# Altium schematic sheet MCU (nrf52840).SchDoc
size A; SheetNumber: 3; SheetTotal: 4
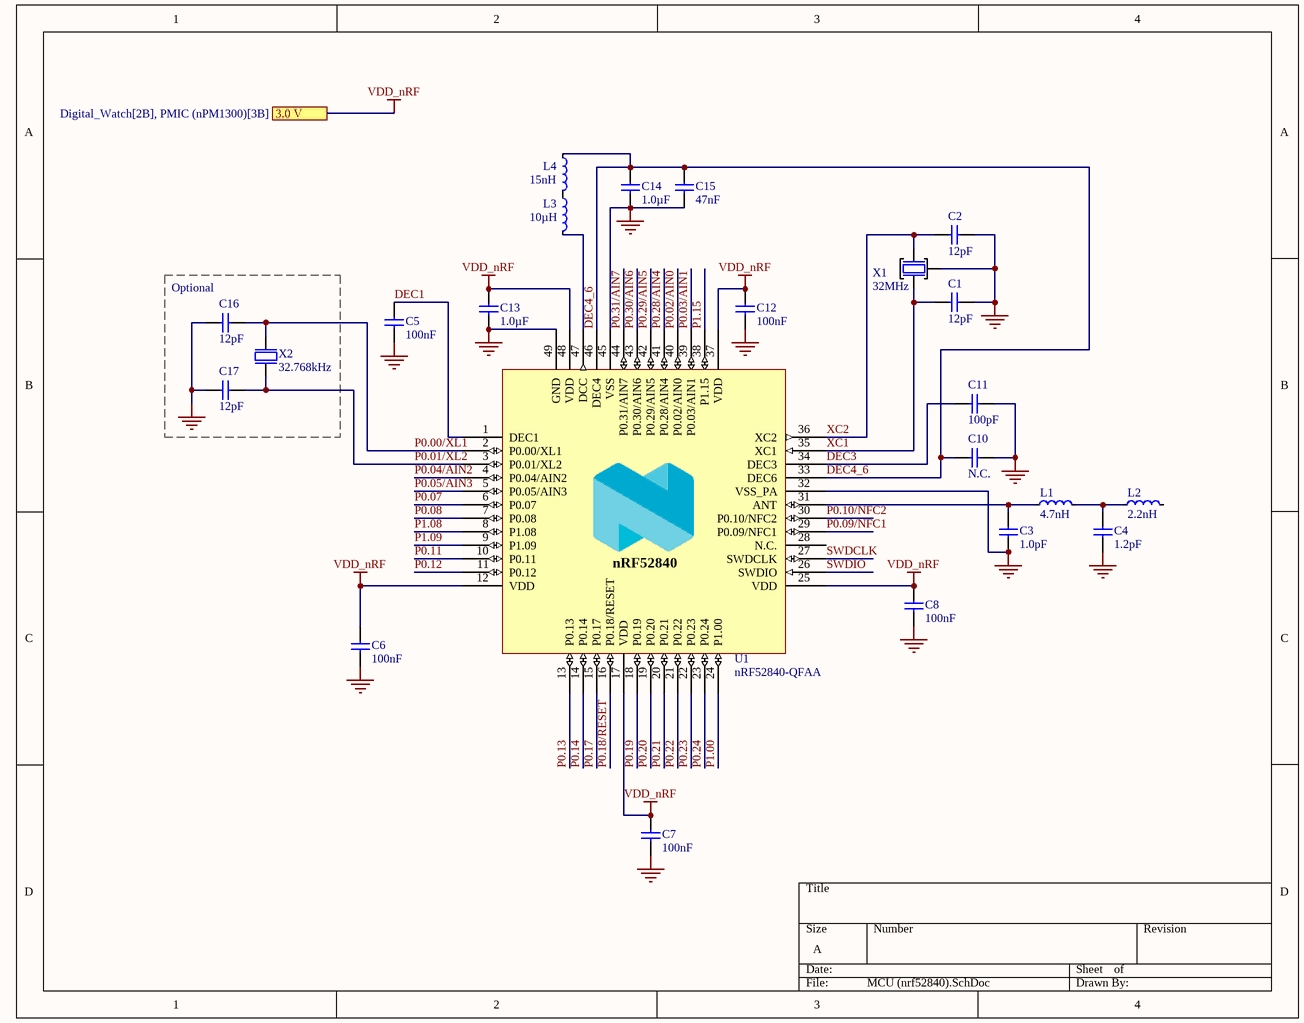
[diagram p0: MCU (nrf52840).SchDoc]

## Parts
C1  12pF  [CAPC0603X03L_C]
C2  12pF  [CAPC0603X03L_C]
C3  1.0pF  [CAPC0603X03L_C]
C4  1.2pF  [CAPC0603X03L_C]
C5  100nF  [CAPC0603X03L_C]
C6  100nF  [CAPC0603X03L_C]
C7  100nF  [CAPC0603X03L_C]
C8  100nF  [CAPC0603X03L_C]
C10  N.C.  [CAPC0603X03L_C_NC]
C11  100pF  [CAPC0603X03L_C]
C12  100nF  [CAPC0603X03L_C]
C13  1.0µF  [CAPC1005X04L]
C14  1.0µF  [CAPC1005X04L]
C15  47nF  [CAPC0603X03L_C]
C16  12pF  [CAPC0603X03L_C]
C17  12pF  [CAPC0603X03L_C]
L1  4.7nH  [INDC0603X03L_C]
L2  2.2nH  [INDC0603X03L_C]
L3  10µH  [INDC1608X06L]
L4  15nH  [INDC1005X04L]
U1  nRF52840-QFAA  [QFN40P600X600X90-48N]
X1  32MHz  [XTAL_2016_NT]
X2  32.768kHz  [XTAL_2012]

## Blocks framed on the sheet
Optional: C16 C17 X2

## Ports
3.0 V (see Digital_Watch[2B], PMIC (nPM1300)[3B])

## Nets
GND: C1.2 C2.2 C3.1 C4.1 C5.2 C6.2 C7.2 C8.2 C10.1 C11.2 C12.2 C13.2 C14.1 C15.2 C16.2 C17.2 U1.32(VSS_PA) U1.45(VSS) U1.49(GND) X1.2(GND)
VDD_nRF: C6.1 C7.1 C8.1 C12.1 C13.1 U1.12(VDD) U1.17(VDD) U1.25(VDD) U1.37(VDD) U1.48(VDD) ; port 3.0 V
DEC1: C5.1 U1.1(DEC1)
DEC3: C11.1 U1.34(DEC3)
DEC4_6: C10.2 C14.2 C15.1 L4.1 U1.33(DEC6) U1.46(DEC4)
P0.00/XL1: C16.1 U1.2(P0.00/XL1) X2.1(inp)
P0.01/XL2: C17.1 U1.3(P0.01/XL2) X2.2(out)
P0.02/AIN0: U1.40(P0.02/AIN0)
P0.03/AIN1: U1.39(P0.03/AIN1)
P0.04/AIN2: U1.4(P0.04/AIN2)
P0.05/AIN3: U1.5(P0.05/AIN3)
P0.07: U1.6(P0.07)
P0.08: U1.7(P0.08)
P0.09/NFC1: U1.29(P0.09/NFC1)
P0.10/NFC2: U1.30(P0.10/NFC2)
P0.11: U1.10(P0.11)
P0.12: U1.11(P0.12)
P0.13: U1.13(P0.13)
P0.14: U1.14(P0.14)
P0.17: U1.15(P0.17)
P0.18/RESET: U1.16(P0.18/RESET)
P0.19: U1.18(P0.19)
P0.20: U1.19(P0.20)
P0.21: U1.20(P0.21)
P0.22: U1.21(P0.22)
P0.23: U1.22(P0.23)
P0.24: U1.23(P0.24)
P0.28/AIN4: U1.41(P0.28/AIN4)
P0.29/AIN5: U1.42(P0.29/AIN5)
P0.30/AIN6: U1.43(P0.30/AIN6)
P0.31/AIN7: U1.44(P0.31/AIN7)
P1.00: U1.24(P1.00)
P1.08: U1.8(P1.08)
P1.09: U1.9(P1.09)
P1.15: U1.38(P1.15)
SWDCLK: U1.27(SWDCLK)
SWDIO: U1.26(SWDIO)
XC1: C1.1 U1.35(XC1) X1.1(IN)
XC2: C2.1 U1.36(XC2) X1.3(OUT)
NetC3_2: C3.2 L1.1 U1.31(ANT)
NetC4_2: C4.2 L1.2 L2.1
NetL3_1: L3.1 L4.2
NetL3_2: L3.2 U1.47(DCC)

Not connected (* = marked no-connect by the designer): L2 2; U1 28(N.C.)

## Notes on the sheet
- (in symbol nRF52840-QFAA) nRF52840

## Library data of the parts
C1 C2 C16 C17 = C0201-12p: Capacitor, NP0, ±2%; Pad Count: 2; Part Number: C0201-12p; LatestRevisionDate: 2017-11-09; Published: 2014-11-13; Value: 12pF; Footprint Doc: 0201; Component Class: Capacitors
C3 = C0201-1.0p: Capacitor, NP0, ±10%; Pad Count: 2; Part Number: C0201-1.0p; LatestRevisionDate: 2018-10-22; Published: 2014-11-13; Value: 1.0pF; Footprint Doc: 0201; Component Class: Capacitors
C4 = C0201-1.2p: Capacitor, NP0, ±10%; Pad Count: 2; Part Number: C0201-1.2p; LatestRevisionDate: 2020-10-13; Published: 2014-11-13; Value: 1.2pF; Footprint Doc: 0201; Component Class: Capacitors
C5-C8 C12 = C0201-100n: Capacitor, X5R, ±10%; Pad Count: 2; Part Number: C0201-100n; LatestRevisionDate: 2017-11-09; Published: 2014-11-13; Value: 100nF; Footprint Doc: 0201; Component Class: Capacitors
C10 = C0201-N.C.: Not mounted; Assembly: Not mounted; Pad Count: 2; Part Number: C0201-N.C.; LatestRevisionDate: 2014-11-13; Published: 2014-11-13; Value: N.C.; Footprint Doc: 0201; Component Class: Capacitors
C11 = C0201-100p: Capacitor, NP0, ±5%; Pad Count: 2; Part Number: C0201-100p; LatestRevisionDate: 2019-04-16; Published: 2019-04-16; Value: 100pF; Footprint Doc: 0201; Component Class: Capacitors
C13 C14 = C0402-1µ0: Capacitor, X5R, ±10%; Pad Count: 2; Part Number: C0402-1µ0; LatestRevisionDate: 2016-08-22; Published: 2009-05-08; Value: 1.0µF; Footprint Doc: 0402; Component Class: Capacitors
C15 = C0201-47n: Capacitor, X5R, ±10%; Pad Count: 2; Part Number: C0201-47n; LatestRevisionDate: 2017-11-09; Published: 2014-11-13; Value: 47nF; Footprint Doc: 0201; Component Class: Capacitors
L1 = L0201-4n7: High frequency chip inductor ±5%; Pad Count: 2; Part Number: L0201-4n7; LatestRevisionDate: 2013-04-10; Published: 2013-04-10; Value: 4.7nH; Footprint Doc: 0201; Component Class: Inductors
L2 = L0201-2n2: High frequency chip inductor ±5%; Pad Count: 2; Part Number: L0201-2n2; LatestRevisionDate: 2013-04-10; Published: 2013-04-10; Value: 2.2nH; Footprint Doc: 0201; Component Class: Inductors
L3 = L0603-10µ-TDK: Chip inductor, IDC,min = 50 mA, ±20%; Pad Count: 2; Part Number: L0603-10µ-TDK; LatestRevisionDate: 2012-09-19; Published: 2019-05-06; Value: 10µH; Footprint Doc: 0603; Component Class: Inductors
L4 = L0402-15n: High frequency chip inductor ±10%; Pad Count: 2; Part Number: L0402-15n; LatestRevisionDate: 2012-09-19; Published: 2010-07-12; Value: 15nH; Footprint Doc: 0402; Component Class: Inductors
U1 = nRF52840-QFAA: Multi-protocol Bluetooth Low Energy, IEEE 802.15.4, ANT and 2.4GHz proprietary system-on-chip; Pad Count: 48; Part Number: nRF52840-QFAA; LatestRevisionDate: 2016-11-22; Published: 2016-03-31; Value: nRF52840-QFAA; Footprint Doc: QFN-48; Component Class: nRF_Devices
X1 = XTAL_SMD2016_32MHz_8pF_General_NT: XTAL SMD 2016, 32MHz, Cl=8pF, Total Tol: ±30ppm; Pad Count: 4; Part Number: XTAL_SMD2016_32MHz_8pF_General_NT; LatestRevisionDate: 2021-04-08; Published: 2021-04-08; Value: 32MHz; Footprint Doc: XTAL_2016; Component Class: Oscillators
X2 = XTAL_SMD2012_32.768kHz_9pF_General: XTAL SMD 2012, 32.768kHz, Cl=9pF, Total Tol: ±50ppm; Pad Count: 2; Part Number: XTAL_SMD2012_32.768kHz_9pF_General; LatestRevisionDate: 2017-01-11; Published: 2016-08-19; Value: 32.768kHz; Footprint Doc: XTAL_2012; Component Class: Oscillators